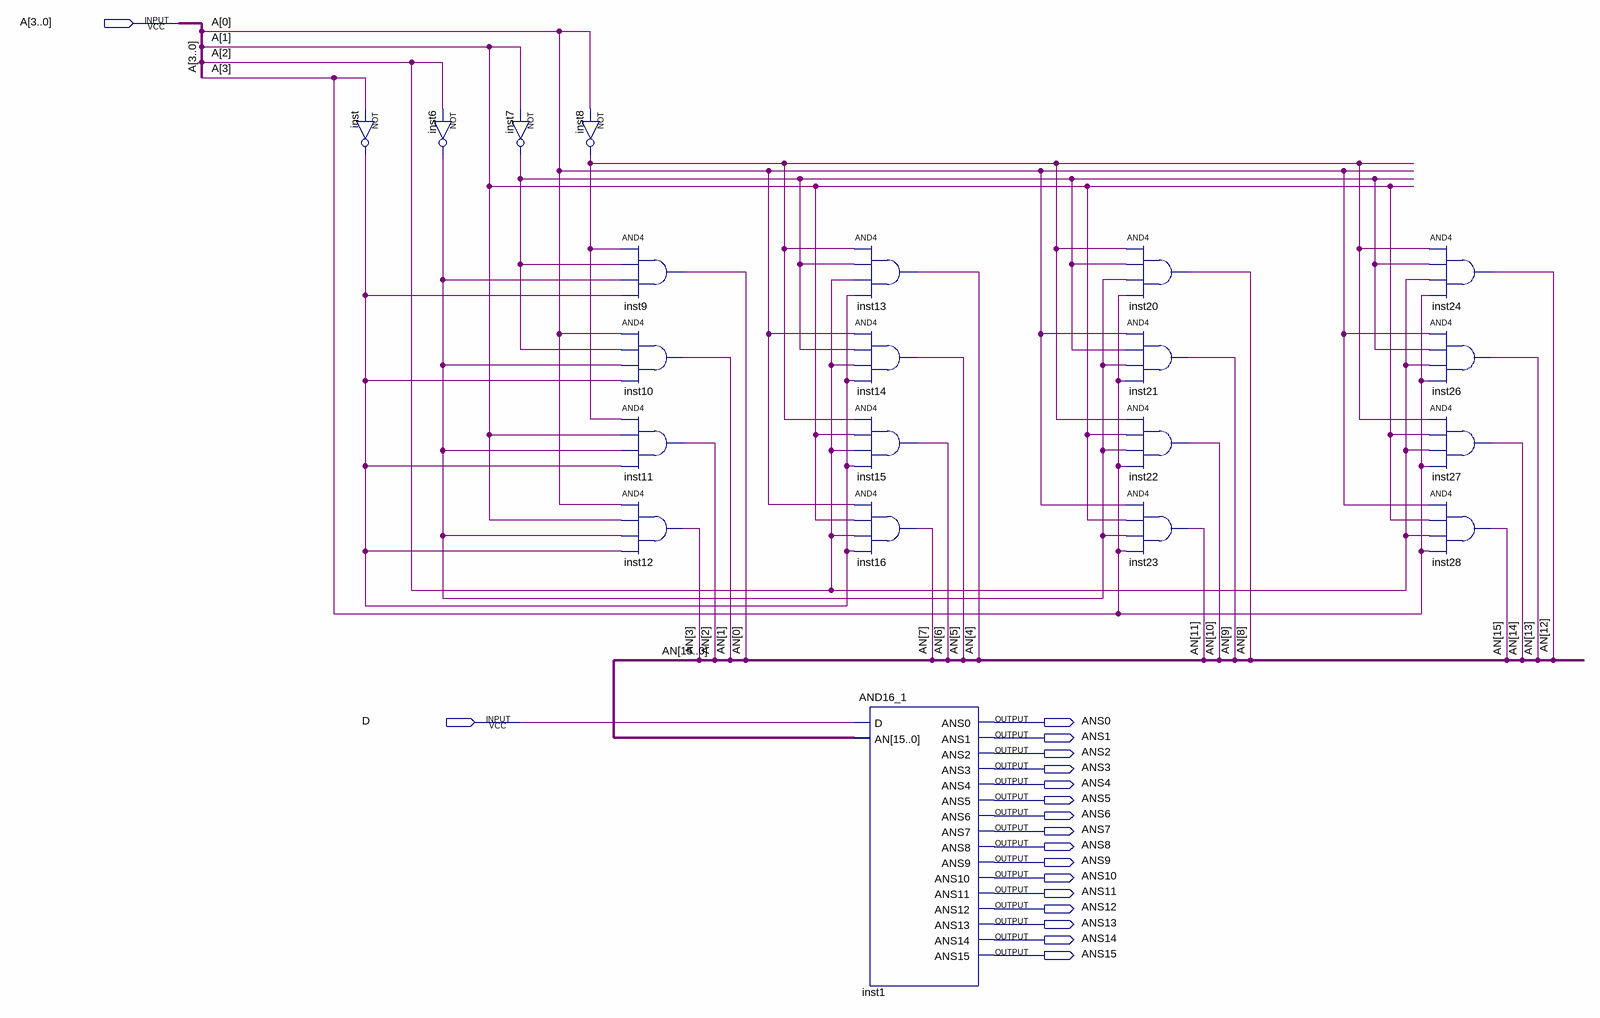
[diagram p0: schematic sheet]
// Quartus schematic Demux16.bdf as structural Verilog: 21 symbols, 18 pins
module Demux16 (
  input  [3:0] A,
  input  D,
  output ANS0,
  output ANS1,
  output ANS2,
  output ANS3,
  output ANS4,
  output ANS5,
  output ANS6,
  output ANS7,
  output ANS8,
  output ANS9,
  output ANS10,
  output ANS11,
  output ANS12,
  output ANS13,
  output ANS14,
  output ANS15
);

  wire inst6_out, inst7_out, inst8_out, inst_out;
  wire [15:0] AN;

  not inst (inst_out, A[3]);
  not inst6 (inst6_out, A[2]);
  not inst7 (inst7_out, A[1]);
  not inst8 (inst8_out, A[0]);
  and inst9 (AN[0], inst8_out, inst7_out, inst6_out, inst_out);
  and inst10 (AN[1], A[0], inst7_out, inst6_out, inst_out);
  and inst11 (AN[2], inst8_out, A[1], inst6_out, inst_out);
  and inst12 (AN[3], A[0], A[1], inst6_out, inst_out);
  and inst13 (AN[4], inst8_out, inst7_out, A[2], inst_out);
  and inst14 (AN[5], A[0], inst7_out, A[2], inst_out);
  and inst15 (AN[6], inst8_out, A[1], A[2], inst_out);
  and inst16 (AN[7], A[0], A[1], A[2], inst_out);
  AND16_1 inst1 (
    .D(D), .AN(AN), .ANS0(ANS0), .ANS1(ANS1), .ANS2(ANS2), .ANS3(ANS3), .ANS4(ANS4), .ANS5(ANS5),
    .ANS6(ANS6), .ANS7(ANS7), .ANS8(ANS8), .ANS9(ANS9), .ANS10(ANS10), .ANS11(ANS11), .ANS12(ANS12),
    .ANS13(ANS13), .ANS14(ANS14), .ANS15(ANS15));
  and inst20 (AN[8], inst8_out, inst7_out, inst6_out, A[3]);
  and inst21 (AN[9], A[0], inst7_out, inst6_out, A[3]);
  and inst22 (AN[10], inst8_out, A[1], inst6_out, A[3]);
  and inst23 (AN[11], A[0], A[1], inst6_out, A[3]);
  and inst24 (AN[12], inst8_out, inst7_out, A[2], A[3]);
  and inst26 (AN[13], A[0], inst7_out, A[2], A[3]);
  and inst27 (AN[14], inst8_out, A[1], A[2], A[3]);
  and inst28 (AN[15], A[0], A[1], A[2], A[3]);
endmodule
